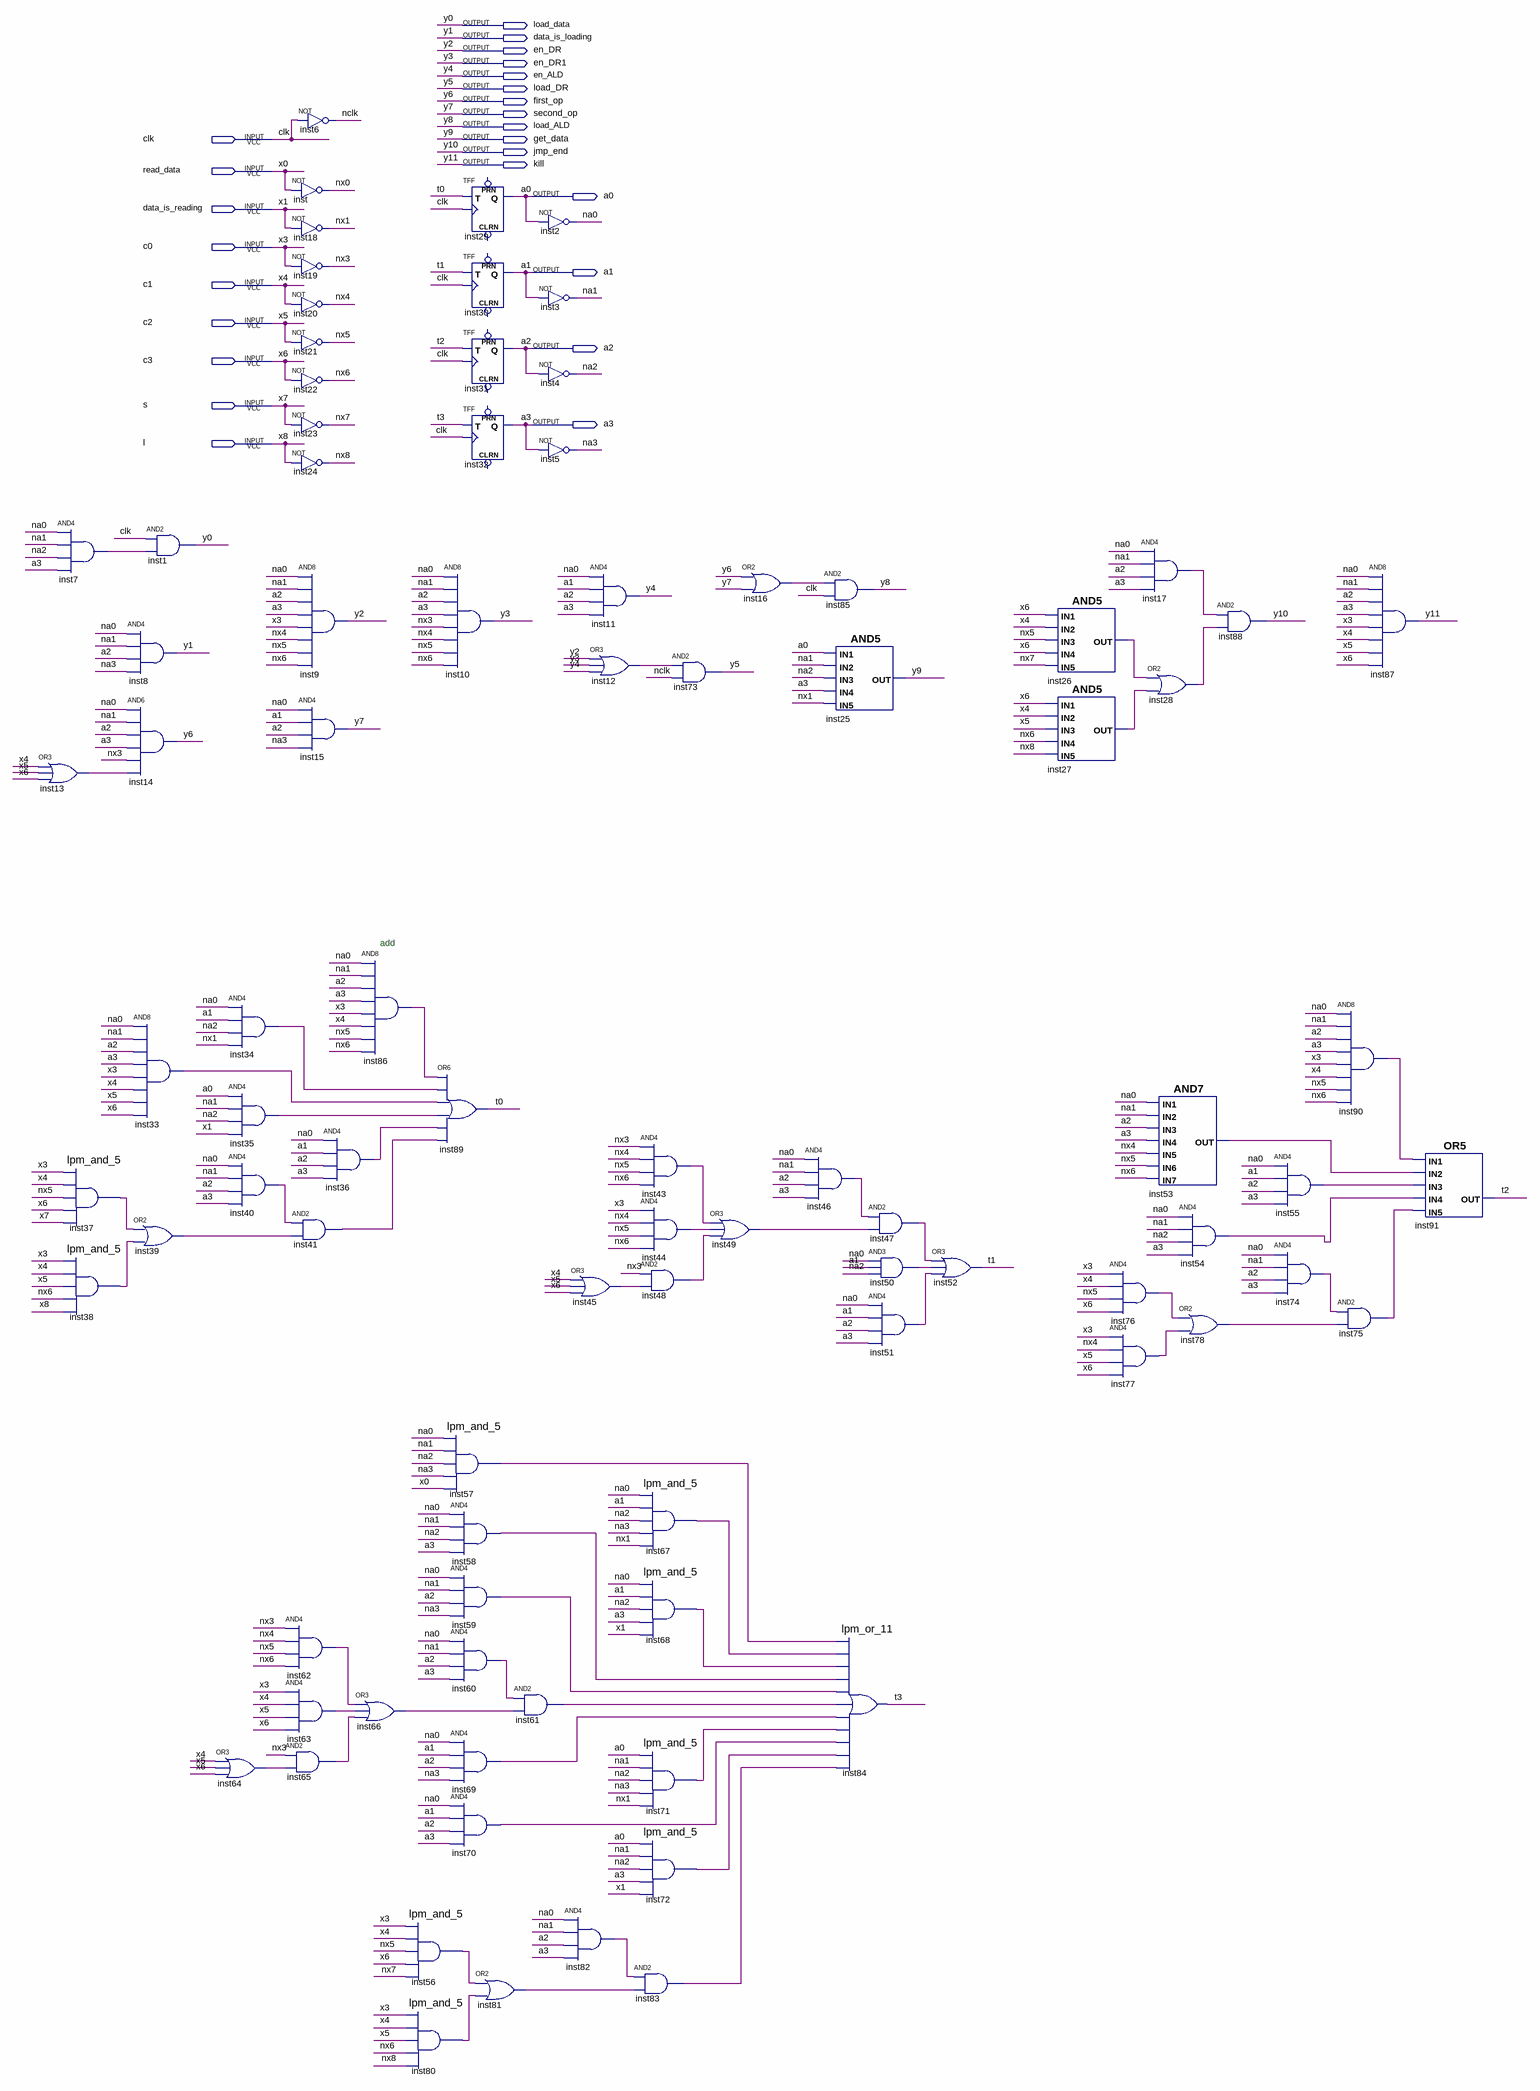
[diagram p0: schematic sheet]
// Quartus schematic execute_command.bdf as structural Verilog: 90 symbols, 25 pins
module execute_command (
  input  clk,
  input  read_data,
  input  data_is_reading,
  input  c0,
  input  c1,
  input  c2,
  input  c3,
  input  s,
  input  l,
  output load_data,
  output data_is_loading,
  output en_DR,
  output en_DR1,
  output en_ALD,
  output load_DR,
  output first_op,
  output second_op,
  output load_ALD,
  output get_data,
  output jmp_end,
  output kill,
  output a0,
  output a1,
  output a2,
  output a3
);

  wire inst7_out, inst12_out, inst13_out, inst16_out, inst17_out, inst26_out, inst27_out, inst28_out,
       inst33_out, inst34_out, inst35_out, inst36_out, inst37_result, inst38_result, inst39_out, inst40_out,
       inst41_out, inst43_out, inst44_out, inst45_out, inst46_out, inst47_out, inst48_out, inst49_out,
       inst50_out, inst51_out, inst53_out, inst54_out, inst55_out, inst56_result, inst57_result, inst58_out,
       inst59_out, inst60_out, inst61_out, inst62_out, inst63_out, inst64_out, inst65_out, inst66_out,
       inst67_result, inst68_result, inst69_out, inst70_out, inst71_result, inst72_result, inst74_out,
       inst75_out, inst76_out, inst77_out, inst78_out, inst80_result, inst81_out, inst82_out, inst83_out,
       inst86_out, inst90_out, na0, na1, na2, na3, nclk, nx0, nx1, nx3, nx4, nx5, nx6, nx7, nx8, t0, t1, t2,
       t3;

  or inst13 (inst13_out, c1, c2, c3);
  and inst7 (inst7_out, na0, na1, na2, a3);
  lpm_and_5 inst37 (.data0(c0), .data1(c1), .data2(nx5), .data3(c3), .data4(s), .result(inst37_result));
  lpm_and_5 inst38 (.data0(c0), .data1(c1), .data2(c2), .data3(nx6), .data4(l), .result(inst38_result));
  and inst1 (load_data, clk, inst7_out);
  and inst8 (data_is_loading, na0, na1, a2, na3);
  and inst14 (first_op, na0, na1, a2, a3, nx3, inst13_out);
  and inst33 (inst33_out, na0, na1, a2, a3, c0, c1, c2, c3);
  or inst39 (inst39_out, inst37_result, inst38_result);
  and inst34 (inst34_out, na0, a1, na2, nx1);
  and inst35 (inst35_out, a0, na1, na2, data_is_reading);
  and inst40 (inst40_out, na0, na1, a2, a3);
  or inst64 (inst64_out, c1, c2, c3);
  not inst6 (nclk, clk);
  not inst (nx0, read_data);
  not inst18 (nx1, data_is_reading);
  not inst19 (nx3, c0);
  not inst20 (nx4, c1);
  not inst21 (nx5, c2);
  not inst22 (nx6, c3);
  not inst23 (nx7, s);
  not inst24 (nx8, l);
  and inst9 (en_DR, na0, na1, a2, a3, c0, nx4, nx5, nx6);
  and inst15 (second_op, na0, a1, a2, na3);
  and inst41 (inst41_out, inst40_out, inst39_out);
  and inst62 (inst62_out, nx3, nx4, nx5, nx6);
  and inst63 (inst63_out, c0, c1, c2, c3);
  and inst65 (inst65_out, nx3, inst64_out);
  and inst36 (inst36_out, na0, a1, a2, a3);
  or inst66 (inst66_out, inst62_out, inst63_out, inst65_out);
  and inst86 (inst86_out, na0, na1, a2, a3, c0, c1, nx5, nx6);
  lpm_and_5 inst56 (.data0(c0), .data1(c1), .data2(nx5), .data3(c3), .data4(nx7), .result(inst56_result));
  lpm_and_5 inst80 (.data0(c0), .data1(c1), .data2(c2), .data3(nx6), .data4(nx8), .result(inst80_result));
  and inst10 (en_DR1, na0, na1, a2, a3, nx3, nx4, nx5, nx6);
  or inst89 (t0, inst86_out, inst34_out, inst33_out, inst35_out, inst36_out, inst41_out);
  lpm_and_5 inst57 (.data0(na0), .data1(na1), .data2(na2), .data3(na3), .data4(read_data), .result(inst57_result));
  and inst58 (inst58_out, na0, na1, na2, a3);
  and inst59 (inst59_out, na0, na1, a2, na3);
  and inst60 (inst60_out, na0, na1, a2, a3);
  and inst69 (inst69_out, na0, a1, a2, na3);
  and inst70 (inst70_out, na0, a1, a2, a3);
  TFF inst29 (.T(t0), .CLK(clk), .Q(a0));  // open: PRN, CLRN
  TFF inst30 (.T(t1), .CLK(clk), .Q(a1));  // open: PRN, CLRN
  TFF inst31 (.T(t2), .CLK(clk), .Q(a2));  // open: PRN, CLRN
  TFF inst32 (.T(t3), .CLK(clk), .Q(a3));  // open: PRN, CLRN
  or inst81 (inst81_out, inst56_result, inst80_result);
  not inst2 (na0, a0);
  not inst3 (na1, a1);
  not inst4 (na2, a2);
  not inst5 (na3, a3);
  and inst61 (inst61_out, inst60_out, inst66_out);
  and inst11 (en_ALD, na0, a1, a2, a3);
  or inst12 (inst12_out, en_DR, en_DR1, en_ALD);
  or inst45 (inst45_out, c1, c2, c3);
  and inst82 (inst82_out, na0, na1, a2, a3);
  and inst43 (inst43_out, nx3, nx4, nx5, nx6);
  and inst44 (inst44_out, c0, nx4, nx5, nx6);
  and inst48 (inst48_out, nx3, inst45_out);
  lpm_and_5 inst67 (.data0(na0), .data1(a1), .data2(na2), .data3(na3), .data4(nx1), .result(inst67_result));
  lpm_and_5 inst68 (.data0(na0), .data1(a1), .data2(na2), .data3(a3), .data4(data_is_reading), .result(inst68_result));
  lpm_and_5 inst71 (.data0(a0), .data1(na1), .data2(na2), .data3(na3), .data4(nx1), .result(inst71_result));
  lpm_and_5 inst72 (.data0(a0), .data1(na1), .data2(na2), .data3(a3), .data4(data_is_reading), .result(inst72_result));
  and inst83 (inst83_out, inst82_out, inst81_out);
  and inst73 (load_DR, inst12_out, nclk);
  or inst49 (inst49_out, inst43_out, inst44_out, inst48_out);
  or inst16 (inst16_out, first_op, second_op);
  and inst46 (inst46_out, na0, na1, a2, a3);
  and inst85 (load_ALD, inst16_out, clk);
  and inst25 (get_data, a0, na1, na2, a3, nx1);
  lpm_or_11 inst84 (
    .data0(inst57_result), .data1(inst67_result), .data2(inst68_result), .data3(inst58_out),
    .data4(inst59_out), .data5(inst61_out), .data6(inst69_out), .data7(inst71_result), .data8(inst70_out),
    .data9(inst72_result), .data10(inst83_out), .result(t3));
  and inst47 (inst47_out, inst46_out, inst49_out);
  and inst50 (inst50_out, na0, a1, na2);
  and inst51 (inst51_out, na0, a1, a2, a3);
  or inst52 (t1, inst47_out, inst50_out, inst51_out);
  and inst26 (inst26_out, c3, c1, nx5, c3, nx7);
  and inst27 (inst27_out, c3, c1, c2, nx6, nx8);
  and inst76 (inst76_out, c0, c1, nx5, c3);
  and inst77 (inst77_out, c0, nx4, c2, c3);
  and inst17 (inst17_out, na0, na1, a2, a3);
  or inst28 (inst28_out, inst26_out, inst27_out);
  and inst53 (inst53_out, na0, na1, a2, a3, nx4, nx5, nx6);
  and inst88 (jmp_end, inst17_out, inst28_out);
  and inst54 (inst54_out, na0, na1, na2, a3);
  or inst78 (inst78_out, inst76_out, inst77_out);
  and inst55 (inst55_out, na0, a1, a2, a3);
  and inst74 (inst74_out, na0, na1, a2, a3);
  and inst87 (kill, na0, na1, a2, a3, c0, c1, c2, c3);
  and inst90 (inst90_out, na0, na1, a2, a3, c0, c1, nx5, nx6);
  and inst75 (inst75_out, inst74_out, inst78_out);
  or inst91 (t2, inst90_out, inst53_out, inst55_out, inst54_out, inst75_out);

  // Other names for the same wires on the sheet: x0 = read_data; x1 = data_is_reading; x3 = c0; x4 = c1; x5 = c2;
  //   x6 = c3; x7 = s; x8 = l; y0 = load_data; y1 = data_is_loading; y2 = en_DR; y3 = en_DR1; y4 = en_ALD;
  //   y5 = load_DR; y6 = first_op; y7 = second_op; y8 = load_ALD; y9 = get_data; y10 = jmp_end; y11 = kill

  // Notes on the sheet:
  //   add
endmodule
